# EAGLE schematic UCube_v2_tower (EAGLE 6.1)
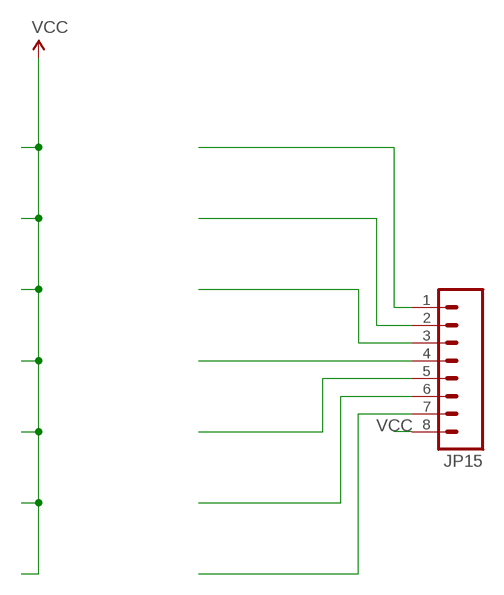
[diagram p0: schematic, sheet 1]

## Parts
JP15  M081X08  [1X08]

## Nets
N$1: JP15.1
N$2: JP15.2
N$3: JP15.3
N$4: JP15.4
N$5: JP15.5
N$6: JP15.6
N$7: JP15.7
VCC: JP15.8

## Library data of the parts
JP15 = SparkFun:M08: Header 8 Standard 8-pin 0.1" header. Use with straight break away headers (SKU : PRT-00116), right angle break away headers (PRT-00553), swiss pins (PRT-00743), machine pins (PRT-00117), and female headers (PRT-00115).